# Altium project 数粒机发射板12通道_补光.PrjPCB
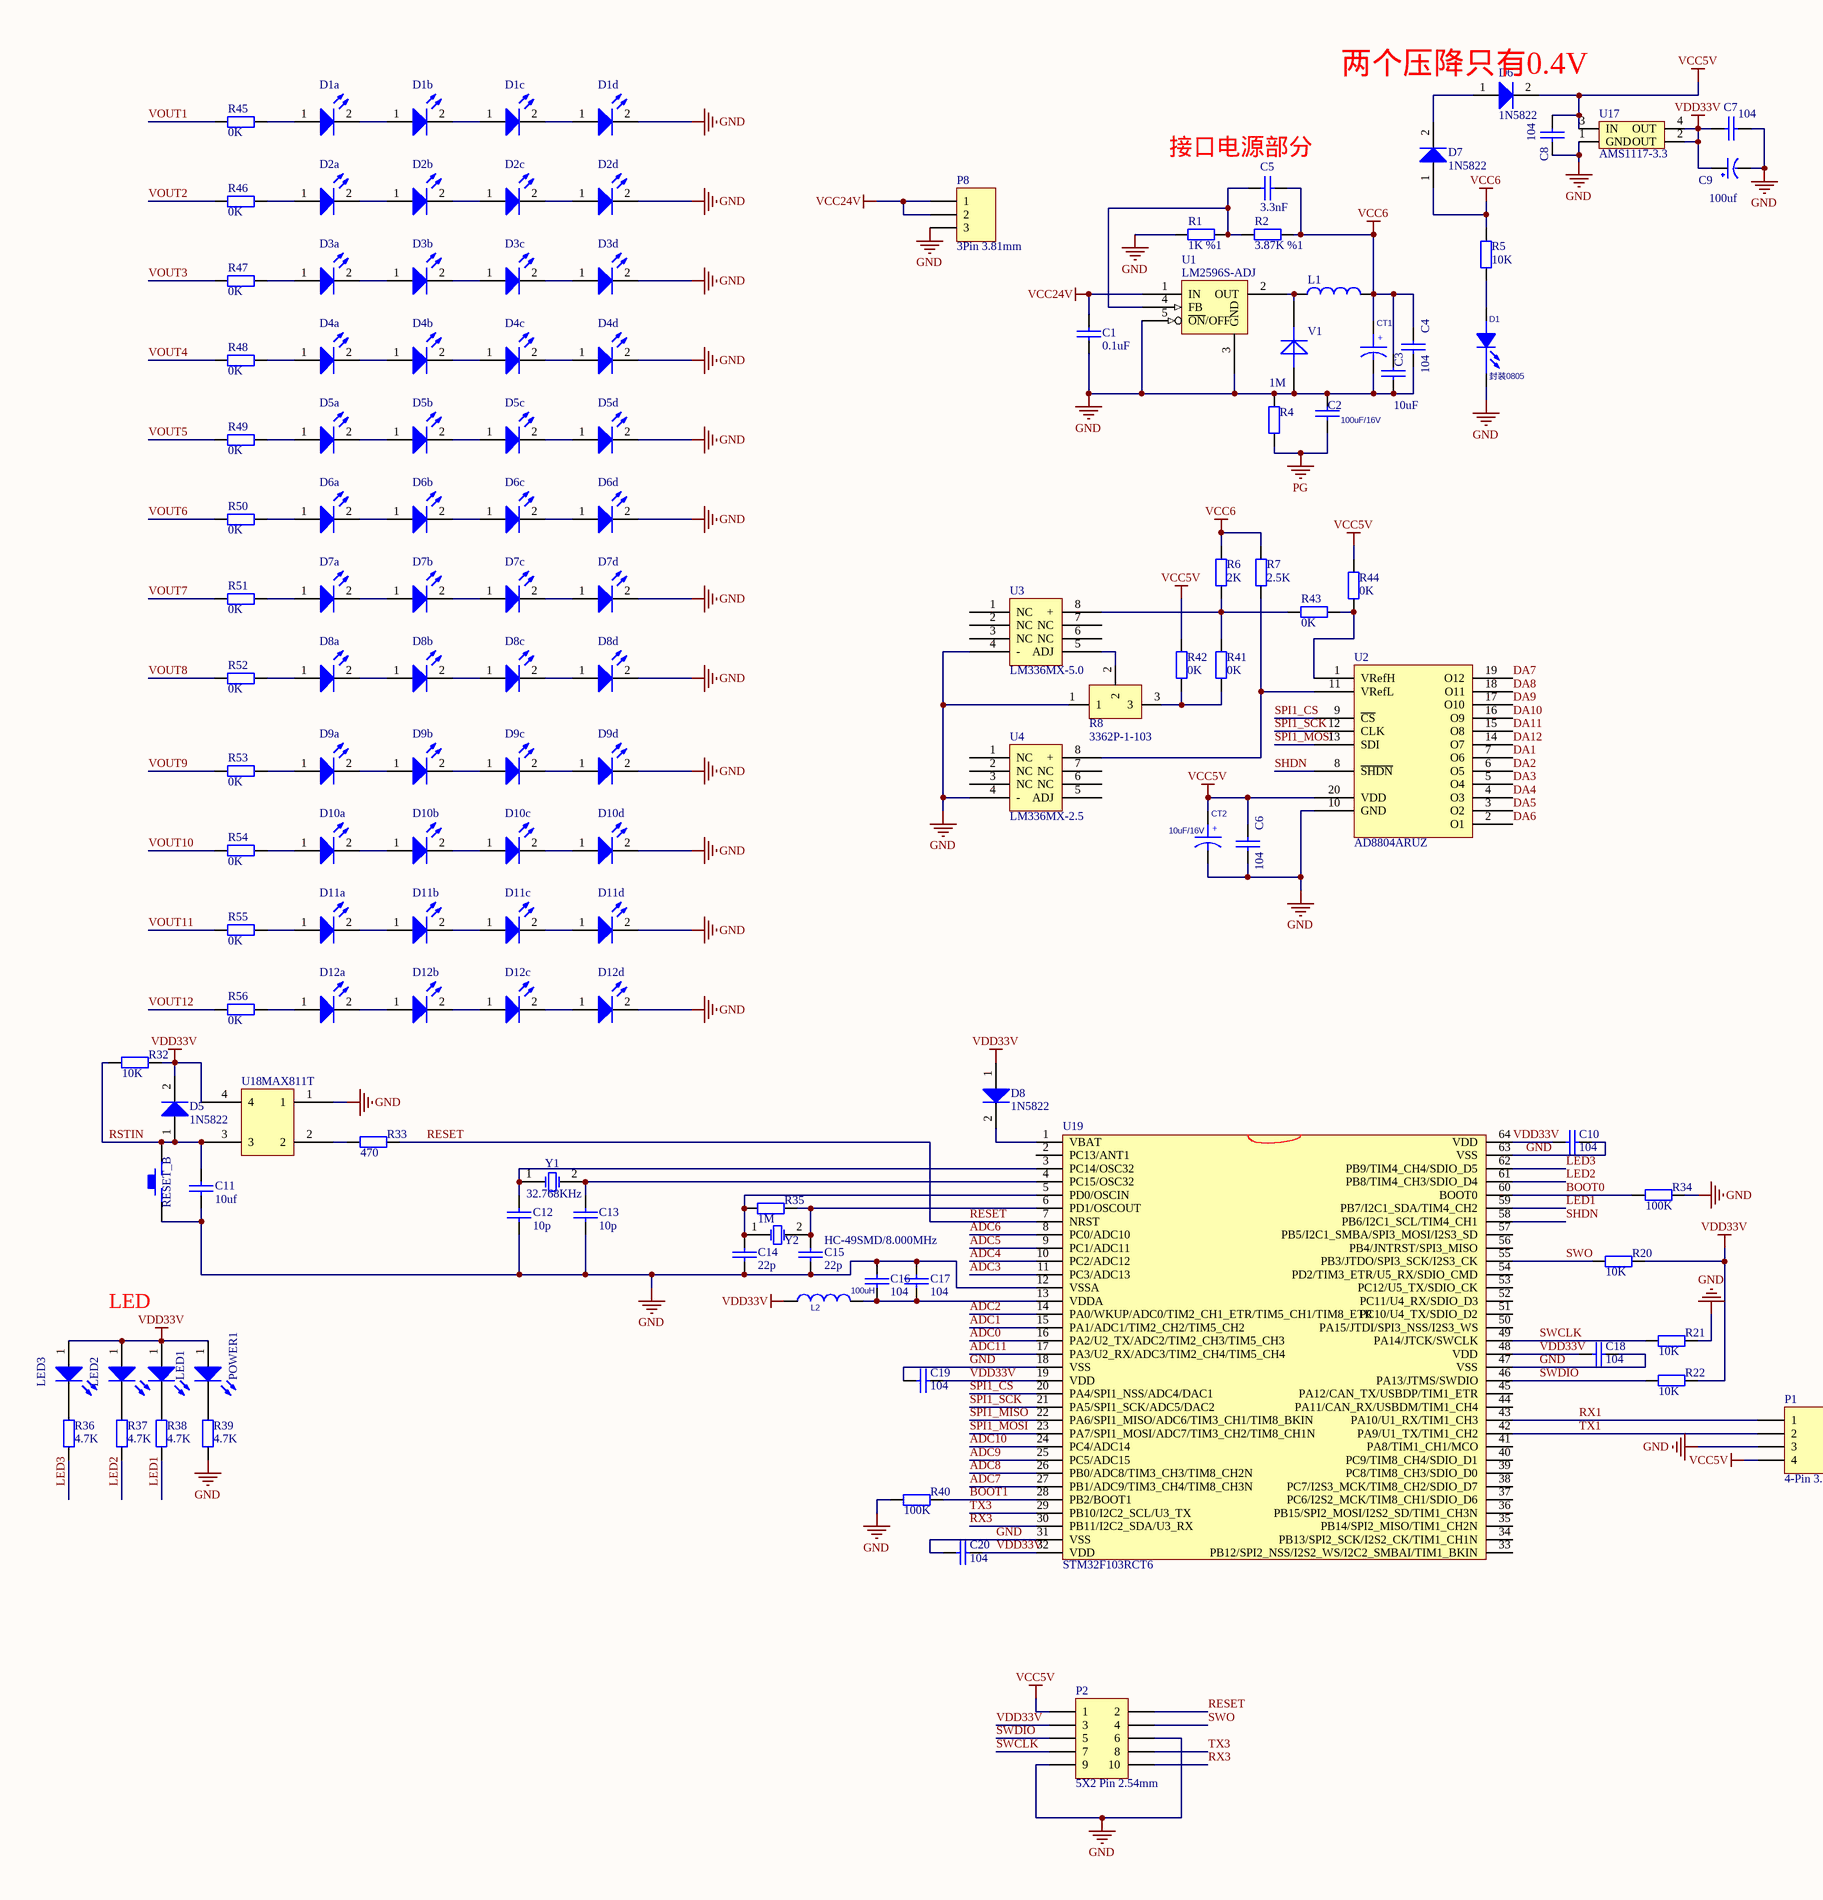
[diagram p0: 数粒机发射板12通道.SchDoc, left]
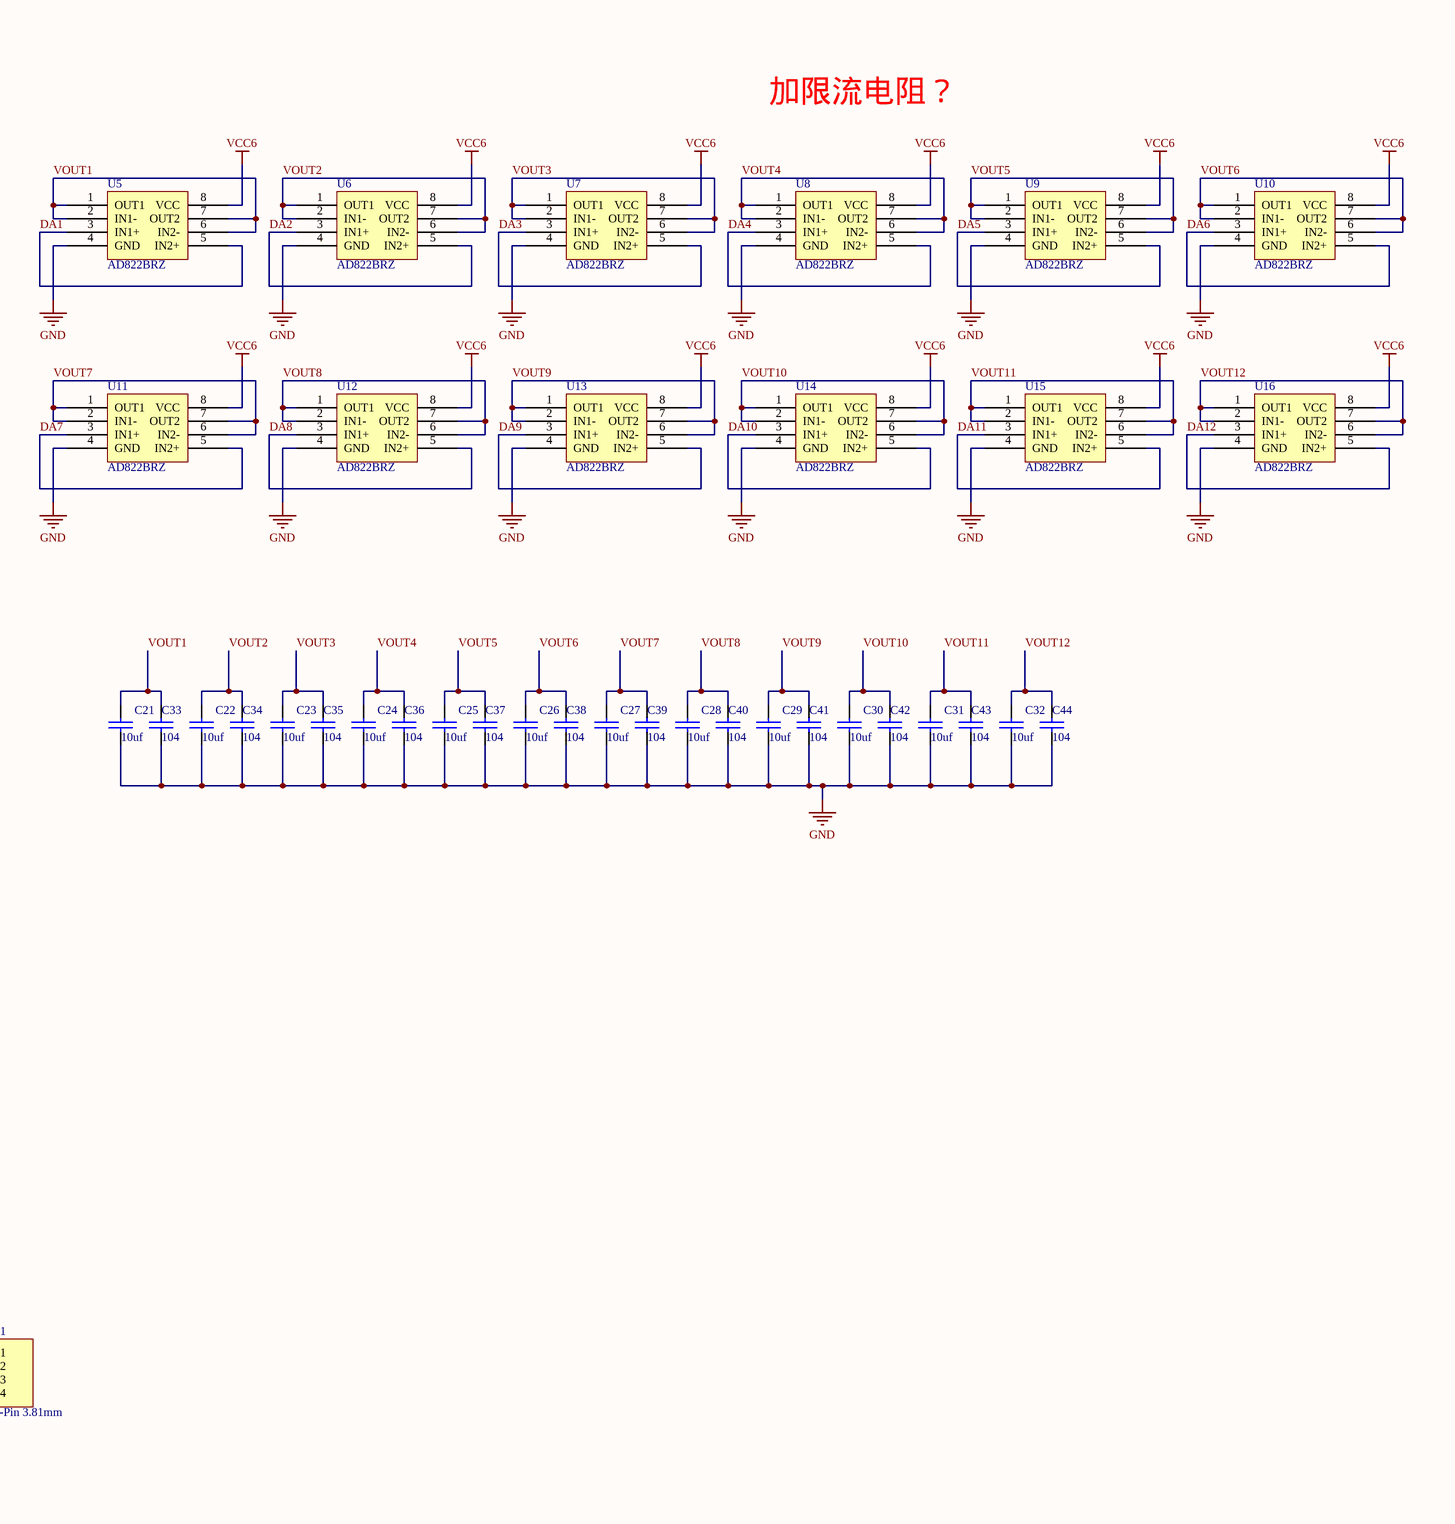
[diagram p1: 数粒机发射板12通道.SchDoc, right]
1 sheet, 166 parts. Net scope: global (net labels, ports and power ports of the same name join across sheets).
Board file: 数粒机发射板12通道.PcbDoc

## Sheet 数粒机发射板12通道.SchDoc
size A1

### Parts
C1  0.1uF  [0805C]
C2  102/2KV  [0805CC]  (value not drawn)
C3  10uF  [0805C]
C4  104  [0805C]
C5  3.3nF  [0805C]
C6  104  [0805C]
C7  104  [0805C]
C8  104  [0805C]
C9  value 100uf  [CC6.56.5]  (hidden comment: 10SEV100M6.3X5.5)
C10  104  [0805C]
C11  10uf  [0805C]
C12  10p  [0805C]
C13  10p  [0805C]
C14  22p  [0805C]
C15  22p  [0805C]
C16  104  [0805C]
C17  104  [0805C]
C18  104  [0805C]
C19  104  [0805C]
C20  104  [0805C]
C21  10uf  [0805C]
C22  10uf  [0805C]
C23  10uf  [0805C]
C24  10uf  [0805C]
C25  10uf  [0805C]
C26  10uf  [0805C]
C27  10uf  [0805C]
C28  10uf  [0805C]
C29  10uf  [0805C]
C30  10uf  [0805C]
C31  10uf  [0805C]
C32  10uf  [0805C]
C33  104  [0805C]
C34  104  [0805C]
C35  104  [0805C]
C36  104  [0805C]
C37  104  [0805C]
C38  104  [0805C]
C39  104  [0805C]
C40  104  [0805C]
C41  104  [0805C]
C42  104  [0805C]
C43  104  [0805C]
C44  104  [0805C]
CT1  100uF/16V  [CT7343]
CT2  10uF/16V  [3528]
D1  封装0805  [LED-0805]
D1a  EL-1KL3  [EL-1KL3]  (value not drawn)
D1b  EL-1KL3  [EL-1KL3]  (value not drawn)
D1c  EL-1KL3  [EL-1KL3]  (value not drawn)
D1d  EL-1KL3  [EL-1KL3]  (value not drawn)
D2a  EL-1KL3  [EL-1KL3]  (value not drawn)
D2b  EL-1KL3  [EL-1KL3]  (value not drawn)
D2c  EL-1KL3  [EL-1KL3]  (value not drawn)
D2d  EL-1KL3  [EL-1KL3]  (value not drawn)
D3a  EL-1KL3  [EL-1KL3]  (value not drawn)
D3b  EL-1KL3  [EL-1KL3]  (value not drawn)
D3c  EL-1KL3  [EL-1KL3]  (value not drawn)
D3d  EL-1KL3  [EL-1KL3]  (value not drawn)
D4a  EL-1KL3  [EL-1KL3]  (value not drawn)
D4b  EL-1KL3  [EL-1KL3]  (value not drawn)
D4c  EL-1KL3  [EL-1KL3]  (value not drawn)
D4d  EL-1KL3  [EL-1KL3]  (value not drawn)
D5  value 1N5822  [D1206]  (hidden comment: 1N5822/1206)
D5a  EL-1KL3  [EL-1KL3]  (value not drawn)
D5b  EL-1KL3  [EL-1KL3]  (value not drawn)
D5c  EL-1KL3  [EL-1KL3]  (value not drawn)
D5d  EL-1KL3  [EL-1KL3]  (value not drawn)
D6  value 1N5822  [D1206]  (hidden comment: 1N5822/1206)
D6a  EL-1KL3  [EL-1KL3]  (value not drawn)
D6b  EL-1KL3  [EL-1KL3]  (value not drawn)
D6c  EL-1KL3  [EL-1KL3]  (value not drawn)
D6d  EL-1KL3  [EL-1KL3]  (value not drawn)
D7  value 1N5822  [D1206]  (hidden comment: 1N5822/1206)
D7a  EL-1KL3  [EL-1KL3]  (value not drawn)
D7b  EL-1KL3  [EL-1KL3]  (value not drawn)
D7c  EL-1KL3  [EL-1KL3]  (value not drawn)
D7d  EL-1KL3  [EL-1KL3]  (value not drawn)
D8  value 1N5822  [D1206]  (hidden comment: 1N5822/1206)
D8a  EL-1KL3  [EL-1KL3]  (value not drawn)
D8b  EL-1KL3  [EL-1KL3]  (value not drawn)
D8c  EL-1KL3  [EL-1KL3]  (value not drawn)
D8d  EL-1KL3  [EL-1KL3]  (value not drawn)
D9a  EL-1KL3  [EL-1KL3]  (value not drawn)
D9b  EL-1KL3  [EL-1KL3]  (value not drawn)
D9c  EL-1KL3  [EL-1KL3]  (value not drawn)
D9d  EL-1KL3  [EL-1KL3]  (value not drawn)
D10a  EL-1KL3  [EL-1KL3]  (value not drawn)
D10b  EL-1KL3  [EL-1KL3]  (value not drawn)
D10c  EL-1KL3  [EL-1KL3]  (value not drawn)
D10d  EL-1KL3  [EL-1KL3]  (value not drawn)
D11a  EL-1KL3  [EL-1KL3]  (value not drawn)
D11b  EL-1KL3  [EL-1KL3]  (value not drawn)
D11c  EL-1KL3  [EL-1KL3]  (value not drawn)
D11d  EL-1KL3  [EL-1KL3]  (value not drawn)
D12a  EL-1KL3  [EL-1KL3]  (value not drawn)
D12b  EL-1KL3  [EL-1KL3]  (value not drawn)
D12c  EL-1KL3  [EL-1KL3]  (value not drawn)
D12d  EL-1KL3  [EL-1KL3]  (value not drawn)
L1  33uH2A  [6045]  (value not drawn)
L2  100uH  [0805]
LED1  封装0805  [LED-0805]  (value not drawn)
LED2  封装0805  [LED-0805]  (value not drawn)
LED3  封装0805  [LED-0805]  (value not drawn)
P1  4-Pin 3.81mm  [con4]
P2  5X2 Pin 2.54mm  [idc-10-b]
P8  3Pin 3.81mm  [CON3]
POWER1  封装0805  [LED-0805]  (value not drawn)
R1  1K %1  [0805R]
R2  3.87K %1  [0805R]
R4  1M  [0805R]
R5  10K  [0805R]
R6  2K  [0805R]
R7  2.5K  [0805R]
R8  3362P-1-103  [VR4]
R20  10K  [0805R]
R21  10K  [0805R]
R22  10K  [0805R]
R32  value 10K  [0805R]  (hidden comment: 1M)
R33  value 470  [0805R]  (hidden comment: 1M)
R34  100K  [0805R]
R35  1M  [0805R]
R36  value 4.7K  [0805R]  (hidden comment: 1M)
R37  value 4.7K  [0805R]  (hidden comment: 1M)
R38  value 4.7K  [0805R]  (hidden comment: 1M)
R39  value 4.7K  [0805R]  (hidden comment: 1M)
R40  100K  [0805R]
R41  0K  [0805R]
R42  0K  [0805R]
R43  0K  [0805R]
R44  0K  [0805R]
R45  0K  [0805R]
R46  0K  [0805R]
R47  0K  [0805R]
R48  0K  [0805R]
R49  0K  [0805R]
R50  0K  [0805R]
R51  0K  [0805R]
R52  0K  [0805R]
R53  0K  [0805R]
R54  0K  [0805R]
R55  0K  [0805R]
R56  0K  [0805R]
RESET_B  3*6*2.5 白色按钮轻触开关 两脚 2P  [button_2]  (value not drawn)
U1  LM2596S-ADJ  [TO-263]
U2  AD8804ARUZ  [tssop20]
U3  LM336MX-5.0  [sop8]
U4  LM336MX-2.5  [sop8]
U5  AD822BRZ  [sop8]
U6  AD822BRZ  [sop8]
U7  AD822BRZ  [sop8]
U8  AD822BRZ  [sop8]
U9  AD822BRZ  [sop8]
U10  AD822BRZ  [sop8]
U11  AD822BRZ  [sop8]
U12  AD822BRZ  [sop8]
U13  AD822BRZ  [sop8]
U14  AD822BRZ  [sop8]
U15  AD822BRZ  [sop8]
U16  AD822BRZ  [sop8]
U17  AMS1117-3.3  [AMS1117]
U18  value MAX811T  [MAX811T]  (hidden comment: MAX811T/SOT143)
U19  STM32F103RCT6  [TQ64]
V1  SK210B  [1812DT]  (value not drawn)
Y1  value 32.768KHz  [32.768khz]  (hidden comment: HC-49DIP/32.768KHz)
Y2  HC-49SMD/8.000MHz  [CRYSTAL_SMD]

### Nets
GND: C1.2 C2.2 C3.2 C4.1 C6.1 C7.1 C8.1 C9.2(GND) C10.1 C11.1 C12.1 C13.1 C14.1 C15.1 C16.2 C17.2 C18.1 C19.2 C20.2 C21.1 C22.1 C23.1 C24.1 C25.1 C26.1 C27.1 C28.1 C29.1 C30.1 C31.1 C32.1 C33.1 C34.1 C35.1 C36.1 C37.1 C38.1 C39.1 C40.1 C41.1 C42.1 C43.1 C44.1 CT1.2(Negative) CT2.2(Negative) D1.2(T-) D1d.2(K) D2d.2(K) D3d.2(K) D4d.2(K) D5d.2(K) D6d.2(K) D7d.2(K) D8d.2(K) D9d.2(K) D10d.2(K) D11d.2(K) D12d.2(K) P1.3 P2.6 P2.9 P8.3 R1.1 R4.1 R8.1 R21.2 R34.2 R39.1 R40.1 RESET_B.1 U1.3(GND) U1.5(~{ON}/OFF) U2.10(GND) U3.4(-) U4.4(-) U5.4(GND) U6.4(GND) U7.4(GND) U8.4(GND) U9.4(GND) U10.4(GND) U11.4(GND) U12.4(GND) U13.4(GND) U14.4(GND) U15.4(GND) U16.4(GND) U17.1(GND) U18.1 U19.12(VSSA) U19.18(VSS) U19.31(VSS) U19.47(VSS) U19.63(VSS) V1.1(A)
PG: C2.1 R4.2
VCC5V: C6.2 C8.2 CT2.1(Positive) D6.2(K) P1.4 P2.1 R42.2 R44.2 U2.20(VDD) U17.3(IN)
VCC6: C3.1 C4.2 C5.1 CT1.1(Positive) D7.1(A) L1.2 R2.2 R5.2 R6.2 R7.2 U5.8(VCC) U6.8(VCC) U7.8(VCC) U8.8(VCC) U9.8(VCC) U10.8(VCC) U11.8(VCC) U12.8(VCC) U13.8(VCC) U14.8(VCC) U15.8(VCC) U16.8(VCC)
VCC24V: C1.1 P8.1 P8.2 U1.1(IN)
VDD33V: C7.2 C9.1(VCC) C10.2 C18.2 C19.1 C20.1 D5.2(K) D8.1(A) L2.1 LED1.1(A) LED2.1(A) LED3.1(A) P2.3 POWER1.1(A) R20.2 R22.2 R32.2 U17.2(OUT) U17.4(OUT) U18.4 U19.19(VDD) U19.32(VDD) U19.48(VDD) U19.64(VDD)
ADC0: U19.16(PA2/U2_TX/ADC2/TIM2_CH3/TIM5_CH3)
ADC1: U19.15(PA1/ADC1/TIM2_CH2/TIM5_CH2)
ADC2: U19.14(PA0/WKUP/ADC0/TIM2_CH1_ETR/TIM5_CH1/TIM8_ETR)
ADC3: U19.11(PC3/ADC13)
ADC4: U19.10(PC2/ADC12)
ADC5: U19.9(PC1/ADC11)
ADC6: U19.8(PC0/ADC10)
ADC7: U19.27(PB1/ADC9/TIM3_CH4/TIM8_CH3N)
ADC8: U19.26(PB0/ADC8/TIM3_CH3/TIM8_CH2N)
ADC9: U19.25(PC5/ADC15)
ADC10: U19.24(PC4/ADC14)
ADC11: U19.17(PA3/U2_RX/ADC3/TIM2_CH4/TIM5_CH4)
BOOT0: R34.1 U19.60(BOOT0)
BOOT1: R40.2 U19.28(PB2/BOOT1)
DA1: U2.7(O6) U5.3(IN1+) U5.5(IN2+)
DA2: U2.6(O5) U6.3(IN1+) U6.5(IN2+)
DA3: U2.5(O4) U7.3(IN1+) U7.5(IN2+)
DA4: U2.4(O3) U8.3(IN1+) U8.5(IN2+)
DA5: U2.3(O2) U9.3(IN1+) U9.5(IN2+)
DA6: U2.2(O1) U10.3(IN1+) U10.5(IN2+)
DA7: U2.19(O12) U11.3(IN1+) U11.5(IN2+)
DA8: U2.18(O11) U12.3(IN1+) U12.5(IN2+)
DA9: U2.17(O10) U13.3(IN1+) U13.5(IN2+)
DA10: U2.16(O9) U14.3(IN1+) U14.5(IN2+)
DA11: U2.15(O8) U15.3(IN1+) U15.5(IN2+)
DA12: U2.14(O7) U16.3(IN1+) U16.5(IN2+)
LED1: R38.1 U19.59(PB7/I2C1_SDA/TIM4_CH2)
LED2: R37.1 U19.61(PB8/TIM4_CH3/SDIO_D4)
LED3: R36.1 U19.62(PB9/TIM4_CH4/SDIO_D5)
RESET: P2.2 R33.2 U19.7(NRST)
RSTIN: C11.2 D5.1(A) R32.1 RESET_B.2 U18.3
RX1: P1.1 U19.43(PA10/U1_RX/TIM1_CH3)
RX3: P2.10 U19.30(PB11/I2C2_SDA/U3_RX)
SHDN: U2.8(~{SHDN}) U19.58(PB6/I2C1_SCL/TIM4_CH1)
SPI1_CS: U2.9(~{CS}) U19.20(PA4/SPI1_NSS/ADC4/DAC1)
SPI1_MISO: U19.22(PA6/SPI1_MISO/ADC6/TIM3_CH1/TIM8_BKIN)
SPI1_MOSI: U2.13(SDI) U19.23(PA7/SPI1_MOSI/ADC7/TIM3_CH2/TIM8_CH1N)
SPI1_SCK: U2.12(CLK) U19.21(PA5/SPI1_SCK/ADC5/DAC2)
SWCLK: P2.7 R21.1 U19.49(PA14/JTCK/SWCLK)
SWDIO: P2.5 R22.1 U19.46(PA13/JTMS/SWDIO)
SWO: P2.4 R20.1 U19.55(PB3/JTDO/SPI3_SCK/I2S3_CK)
TX1: P1.2 U19.42(PA9/U1_TX/TIM1_CH2)
TX3: P2.8 U19.29(PB10/I2C2_SCL/U3_TX)
VOUT1: C21.2 C33.2 R45.2 U5.1(OUT1) U5.2(IN1-) U5.6(IN2-) U5.7(OUT2)
VOUT2: C22.2 C34.2 R46.2 U6.1(OUT1) U6.2(IN1-) U6.6(IN2-) U6.7(OUT2)
VOUT3: C23.2 C35.2 R47.2 U7.1(OUT1) U7.2(IN1-) U7.6(IN2-) U7.7(OUT2)
VOUT4: C24.2 C36.2 R48.2 U8.1(OUT1) U8.2(IN1-) U8.6(IN2-) U8.7(OUT2)
VOUT5: C25.2 C37.2 R49.2 U9.1(OUT1) U9.2(IN1-) U9.6(IN2-) U9.7(OUT2)
VOUT6: C26.2 C38.2 R50.2 U10.1(OUT1) U10.2(IN1-) U10.6(IN2-) U10.7(OUT2)
VOUT7: C27.2 C39.2 R51.2 U11.1(OUT1) U11.2(IN1-) U11.6(IN2-) U11.7(OUT2)
VOUT8: C28.2 C40.2 R52.2 U12.1(OUT1) U12.2(IN1-) U12.6(IN2-) U12.7(OUT2)
VOUT9: C29.2 C41.2 R53.2 U13.1(OUT1) U13.2(IN1-) U13.6(IN2-) U13.7(OUT2)
VOUT10: C30.2 C42.2 R54.2 U14.1(OUT1) U14.2(IN1-) U14.6(IN2-) U14.7(OUT2)
VOUT11: C31.2 C43.2 R55.2 U15.1(OUT1) U15.2(IN1-) U15.6(IN2-) U15.7(OUT2)
VOUT12: C32.2 C44.2 R56.2 U16.1(OUT1) U16.2(IN1-) U16.6(IN2-) U16.7(OUT2)
NetC5_2: C5.2 R1.2 R2.1 U1.4(FB)
NetC12_2: C12.2 U19.3(PC14/OSC32) Y1.1(OSC1)
NetC13_2: C13.2 U19.4(PC15/OSC32) Y1.2(OSC2)
NetC14_2: C14.2 R35.1 U19.5(PD0/OSCIN) Y2.1(OSC1)
NetC15_2: C15.2 R35.2 U19.6(PD1/OSCOUT) Y2.2(OSC2)
NetC16_1: C16.1 C17.1 L2.2 U19.13(VDDA)
NetD1_1: D1.1(B-) R5.1
NetD1a_1: D1a.1(A) R45.1
NetD1a_2: D1a.2(K) D1b.1(A)
NetD1b_2: D1b.2(K) D1c.1(A)
NetD1c_2: D1c.2(K) D1d.1(A)
NetD2a_1: D2a.1(A) R46.1
NetD2a_2: D2a.2(K) D2b.1(A)
NetD2b_2: D2b.2(K) D2c.1(A)
NetD2c_2: D2c.2(K) D2d.1(A)
NetD3a_1: D3a.1(A) R47.1
NetD3a_2: D3a.2(K) D3b.1(A)
NetD3b_2: D3b.2(K) D3c.1(A)
NetD3c_2: D3c.2(K) D3d.1(A)
NetD4a_1: D4a.1(A) R48.1
NetD4a_2: D4a.2(K) D4b.1(A)
NetD4b_2: D4b.2(K) D4c.1(A)
NetD4c_2: D4c.2(K) D4d.1(A)
NetD5a_1: D5a.1(A) R49.1
NetD5a_2: D5a.2(K) D5b.1(A)
NetD5b_2: D5b.2(K) D5c.1(A)
NetD5c_2: D5c.2(K) D5d.1(A)
NetD6_1: D6.1(A) D7.2(K)
NetD6a_1: D6a.1(A) R50.1
NetD6a_2: D6a.2(K) D6b.1(A)
NetD6b_2: D6b.2(K) D6c.1(A)
NetD6c_2: D6c.2(K) D6d.1(A)
NetD7a_1: D7a.1(A) R51.1
NetD7a_2: D7a.2(K) D7b.1(A)
NetD7b_2: D7b.2(K) D7c.1(A)
NetD7c_2: D7c.2(K) D7d.1(A)
NetD8_2: D8.2(K) U19.1(VBAT)
NetD8a_1: D8a.1(A) R52.1
NetD8a_2: D8a.2(K) D8b.1(A)
NetD8b_2: D8b.2(K) D8c.1(A)
NetD8c_2: D8c.2(K) D8d.1(A)
NetD9a_1: D9a.1(A) R53.1
NetD9a_2: D9a.2(K) D9b.1(A)
NetD9b_2: D9b.2(K) D9c.1(A)
NetD9c_2: D9c.2(K) D9d.1(A)
NetD10a_1: D10a.1(A) R54.1
NetD10a_2: D10a.2(K) D10b.1(A)
NetD10b_2: D10b.2(K) D10c.1(A)
NetD10c_2: D10c.2(K) D10d.1(A)
NetD11a_1: D11a.1(A) R55.1
NetD11a_2: D11a.2(K) D11b.1(A)
NetD11b_2: D11b.2(K) D11c.1(A)
NetD11c_2: D11c.2(K) D11d.1(A)
NetD12a_1: D12a.1(A) R56.1
NetD12a_2: D12a.2(K) D12b.1(A)
NetD12b_2: D12b.2(K) D12c.1(A)
NetD12c_2: D12c.2(K) D12d.1(A)
NetL1_1: L1.1 U1.2(OUT) V1.2(K)
NetLED1_2: LED1.2(K) R38.2
NetLED2_2: LED2.2(K) R37.2
NetLED3_2: LED3.2(K) R36.2
NetPOWER1_2: POWER1.2(K) R39.2
NetR6_1: R6.1 R41.2 R43.1 U3.8(+)
NetR7_1: R7.1 U2.11(VRefL) U4.8(+)
NetR8_2: R8.2 U3.5(ADJ)
NetR8_3: R8.3 R41.1 R42.1
NetR33_1: R33.1 U18.2
NetR43_2: R43.2 R44.1 U2.1(VRefH)

Not connected (* = marked no-connect by the designer): U3 1(NC) 2(NC) 3(NC) 6(NC) 7(NC); U4 1(NC) 2(NC) 3(NC) 5(ADJ) 6(NC) 7(NC); U19 2(PC13/ANT1) 33(PB12/SPI2_NSS/I2S2_WS/I2C2_SMBAI/TIM1_BKIN) 34(PB13/SPI2_SCK/I2S2_CK/TIM1_CH1N) 35(PB14/SPI2_MISO/TIM1_CH2N) 36(PB15/SPI2_MOSI/I2S2_SD/TIM1_CH3N) 37(PC6/I2S2_MCK/TIM8_CH1/SDIO_D6) 38(PC7/I2S3_MCK/TIM8_CH2/SDIO_D7) 39(PC8/TIM8_CH3/SDIO_D0) 40(PC9/TIM8_CH4/SDIO_D1) 41(PA8/TIM1_CH1/MCO) 44(PA11/CAN_RX/USBDM/TIM1_CH4) 45(PA12/CAN_TX/USBDP/TIM1_ETR) 50(PA15/JTDI/SPI3_NSS/I2S3_WS) 51(PC10/U4_TX/SDIO_D2) 52(PC11/U4_RX/SDIO_D3) 53(PC12/U5_TX/SDIO_CK) 54(PD2/TIM3_ETR/U5_RX/SDIO_CMD) 56(PB4/JNTRST/SPI3_MISO) 57(PB5/I2C1_SMBA/SPI3_MOSI/I2S3_SD)

### Notes on the sheet
- (near D6) 两个压降只有0.4V
- (near C5) 接口电源部分
- 加限流电阻？
- LED
- (in symbol CAP POL) +

### Library data of the parts
C1 C3 = Pro92D1.TMP_105_9: 贴片电容
C2 C4-C8 C10-C44 = CAP: 贴片电容
C9 = CAP: 贴片电解电容
CT1 CT2 = CAP POL: 钽电容; Vendor Part#: 495-2256-1-ND; Mfg Part#: B45196H3107M409; Vendor: DigiKey; Mfg: Kemet; Specifications: CAP TANTALUM 100UF 16V 20% SMD; Oper. Temp. Range: -55C to 125C; RoHS: Yes; Package: 7343-31
D1 = LED: 二极管(贴片发光红色); Vendor Part#: 160-1426-1-ND; Mfg Part#: LTST-C171KGKT; Vendor: DigiKey; Oper. Temp. Range: -25 to +85C; Specifications: LED GREEN CLEAR THIN 0805 SMD; Mfg: Lite-On Inc; Package: 0805; RoHS: Yes; Mfgr.: Lite-On Inc
D1a D1b D1c D1d D2a D2b D2c D2d D3a D3b D3c D3d D4a D4b D4c D4d D5a D5b D5c D5d D6a D6b D6c D6d D7a D7b D7c D7d D8a D8b D8c D8d D9a D9b D9c D9d D10a D10b D10c D10d D11a D11b D11c D11d D12a D12b D12c D12d = LED0: 红外接收珠子; Published: 8-Jun-2000; LatestRevisionDate: 08-Jul-2005; LatestRevisionNote: Mech Layer 1 removed.; PackageReference: LED-0; Publisher: Altium Limited
D5-D8 = DIODE 1N4148/1206: 二极管(贴片); ERP: 1508036001
L1 = Inductor: 贴片电感; Code_IEC: 1005; Published: 8-Jun-2000; LatestRevisionDate: 17-Jul-2002; LatestRevisionNote: Re-released for DXP Platform.; PackageReference: 0402-A; Publisher: Altium Limited; Code_JEITA: 0402
L2 = FERRITE: 贴片电感; Mfg Part#: BLM18PG121SN1D; Vendor Part#: 490-1037-1-ND; Mfg: Murata; Vendor: DigiKey; Specifications: FERRITE CHIP 120 OHM 2000MA 0603; Oper. Temp. Range: -55C to 125C; Package: 0603; RoHS: Yes
LED1-LED3 = LED_GREEN 0805: 二极管(贴片发光绿色); ERP: 1508038003; value: GREEN 0805
P1 = Header 4: 绿色PCB插座(配插头); LatestRevisionDate: 17-Jul-2002; LatestRevisionNote: Re-released for DXP Platform.; Publisher: Altium Limited
P2 = Header 5X2: JTAG简易牛角插; LatestRevisionDate: 17-Jul-2002; LatestRevisionNote: Re-released for DXP Platform.; Publisher: Altium Limited
P8 = Header 3: 绿色PCB插座(配插头); LatestRevisionDate: 17-Jul-2002; LatestRevisionNote: Re-released for DXP Platform.; Publisher: Altium Limited
POWER1 = LED_GREEN 0805: 二极管(贴片发光红色); ERP: 1508038003; value: RED 0805
R1 R2 R4 R20-R22 R32-R40 = Res2: 贴片电阻; Published: 8-Jun-2000; LatestRevisionDate: 17-Jul-2002; LatestRevisionNote: Re-released for DXP Platform.; PackageReference: AXIAL-0.4; Publisher: Altium Limited
  R1: Value: 1K
  R2: Value: 3.87K
  R4 R35: Value: 1M
  R20-R22: Value: 10K
  R34 R40: Value: 100K
R5-R7 R41-R56 = Res2: 贴片电阻; Value: 1K; Published: 8-Jun-2000; LatestRevisionDate: 17-Jul-2002; LatestRevisionNote: Re-released for DXP Platform.; PackageReference: AXIAL-0.4; Publisher: Altium Limited
R8 = 3362P: 电位器 10K
RESET_B = KEY_M: 贴片按键
U1 = LM2575T5.0(5): 集成电路
U2 = AD8804: 12通道 8位 DAC芯片 TSSOP20
U3 = LM335MX-5.0: 基准电压 5V
U4 = LM335MX-5.0: 基准电压2.5V
U5-U16 = AD822: 集成电路 运算放大器
U17 = AMS1117: 稳压芯片
U18 = Power MAX811T: 集成电路贴片; ERP: 1508056010
U19 = STM32F103RDT6: 集成电路
V1 = DIODE1: 二极管; Footprint: RC22
Y1 = CRYSTAL 12M HC-49SMD: 晶体(直插); ERP: 1508043206; Published: 8-Jun-2000; Publisher: Altium Limited; Revision: July-2002: Re-released for DXP Platform.
Y2 = CRYSTAL 12M HC-49SMD: 晶体(贴片); value: 8M; ERP: 1508043206; Published: 8-Jun-2000; Publisher: Altium Limited; Revision: July-2002: Re-released for DXP Platform.